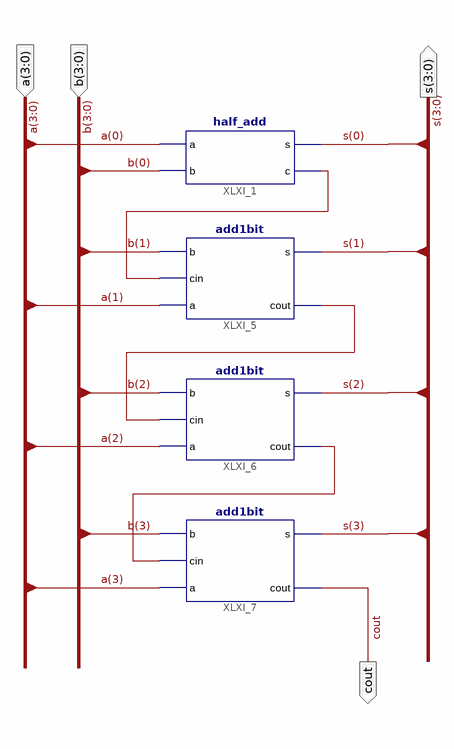
[diagram p0: schematic sheet 1]
// Xilinx ISE schematic add4bits.sch (spartan3e) as structural Verilog: 4 symbols, 4 ports
module add4bits (
  input  [3:0] b,
  input  [3:0] a,
  output [3:0] s,
  output cout
);

  wire XLXN_8, XLXN_9, XLXN_11;

  half_add XLXI_1 (.a(a[0]), .b(b[0]), .s(s[0]), .c(XLXN_8));
  add1bit XLXI_5 (.a(a[1]), .cin(XLXN_8), .b(b[1]), .cout(XLXN_9), .s(s[1]));
  add1bit XLXI_6 (.a(a[2]), .cin(XLXN_9), .b(b[2]), .cout(XLXN_11), .s(s[2]));
  add1bit XLXI_7 (.a(a[3]), .cin(XLXN_11), .b(b[3]), .cout(cout), .s(s[3]));
endmodule
